# EAGLE schematic main (EAGLE 6.2)
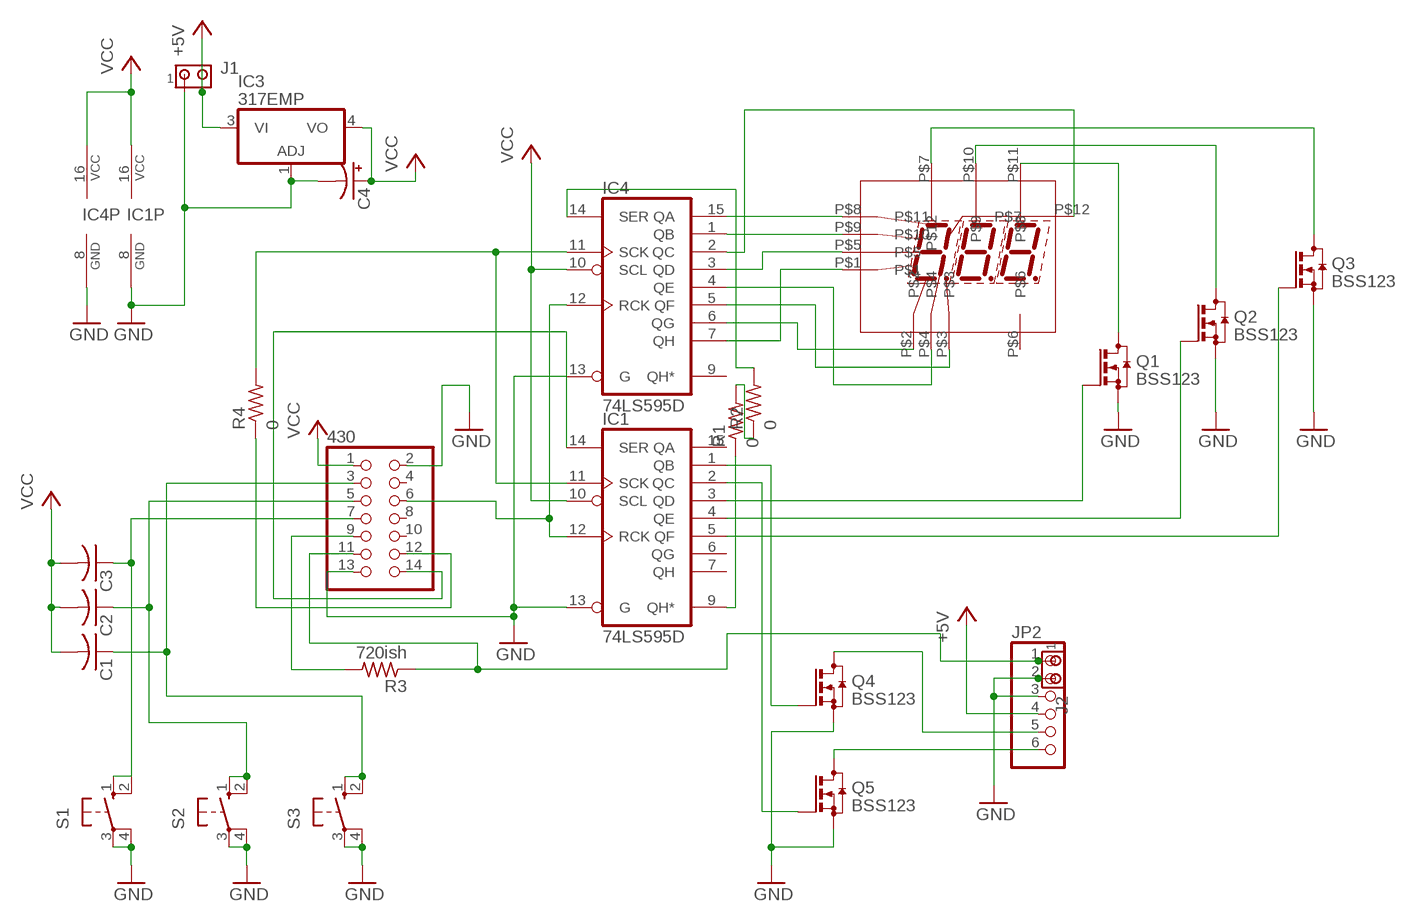
[diagram p0: schematic, sheet 1]

## Parts
430  PINHD-2X7  [2X07]
C1  C-USC0603K  [C0603K]
C2  C-USC0603K  [C0603K]
C3  C-USC0603K  [C0603K]
C4  CPOL-USE2.5-7  [E2,5-7]
IC1  74LS595D  [SO16]
IC3  317EMP  [SOT223]
IC4  74LS595D  [SO16]
J1  MTA02-100  [10X02MTA]
J2  MTA02-100  [10X02MTA]
JP2  PINHD-1X6  [1X06]
Q1  BSS123  [SOT23]
Q2  BSS123  [SOT23]
Q3  BSS123  [SOT23]
Q4  BSS123  [SOT23]
Q5  BSS123  [SOT23]
R1  0  R-US_R0603  [R0603]
R2  0  R-US_R0603  [R0603]
R3  720ish  R-US_R0805  [R0805]
R4  0  R-US_R0603  [R0603]
S1  10-XX  [B3F-10XX]
S2  10-XX  [B3F-10XX]
S3  10-XX  [B3F-10XX]
U$1  BL-T52C-31  [BL-T52X-31]

## Nets
+5V: IC3.3(VI) J1.2 JP2.4
GND: 430.2 430.13 C4.- IC1.8(GND) IC1.13(G) IC3.1(ADJ) IC4.8(GND) IC4.13(G) J1.1 J2.2 JP2.2 JP2.3 Q1.2(S) Q2.2(S) Q3.2(S) Q4.2(S) Q5.2(S) S1.3(P) S1.4(P1) S2.3(P) S2.4(P1) S3.3(P) S3.4(P1)
N$1: IC4.15(QA) U$1.P$8
N$2: IC4.1(QB) U$1.P$9
N$3: IC4.7(QH) U$1.P$1
N$4: IC4.6(QG) U$1.P$2
N$5: IC4.5(QF) U$1.P$3
N$6: IC4.4(QE) U$1.P$4
N$7: IC4.3(QD) U$1.P$5
N$8: IC4.2(QC) U$1.P$12
N$9: Q1.3(D) U$1.P$11
N$10: Q2.3(D) U$1.P$10
N$11: Q3.3(D) U$1.P$7
N$12: IC1.3(QD) Q1.1(G)
N$13: 430.14 IC1.14(SER)
N$14: IC4.14(SER) R2.2
N$15: 430.7 C3.1 S1.1(S) S1.2(S1)
N$16: IC1.9(QH*) R1.1
N$17: 430.11 J2.1 JP2.1 R3.1
N$18: 430.3 C1.1 S3.1(S) S3.2(S1)
N$19: R1.2 R2.1
N$20: IC1.1(QB) Q4.1(G)
N$21: IC1.11(SCK) IC4.11(SCK) R4.2
N$22: IC1.4(QE) Q2.1(G)
N$23: JP2.5 Q4.3(D)
N$24: IC1.5(QF) Q3.1(G)
N$25: IC1.2(QC) Q5.1(G)
N$26: 430.12 R4.1
N$28: JP2.6 Q5.3(D)
N$29: 430.5 C2.1 S2.1(S) S2.2(S1)
N$30: 430.6 IC1.12(RCK) IC4.12(RCK)
N$31: 430.9 R3.2
VCC: 430.1 C1.2 C2.2 C3.2 C4.+ IC1.10(SCL) IC1.16(VCC) IC3.4(VO) IC4.10(SCL) IC4.16(VCC)
Unconnected: 430.4 430.8 430.10 IC1.6(QG) IC1.7(QH) IC1.15(QA) IC4.9(QH*) U$1.P$6

## Library data of the parts
430 = pinhead:PINHD-2X7: PIN HEADER
C1-C3 = rcl:C-US: CAPACITOR, American symbol
C4 = rcl:CPOL-US: POLARIZED CAPACITOR, American symbol
IC1 IC4 = 74xx-us:74*595: 8-bit SHIFT REGISTER, output latch
IC3 = linear:*317: Positive VOLTAGE REGULATOR
J1 J2 = con-amp:MTA02-100: AMP connector
JP2 = pinhead:PINHD-1X6: PIN HEADER
Q1-Q5 = transistor-small-signal:BSS123: N-CHANNEL MOS FET
R1-R4 = rcl:R-US_: RESISTOR, American symbol
S1-S3 = switch-omron:10-XX: OMRON SWITCH; MPN: B3F-1000; OC_FARNELL: 176432; OC_NEWARK: 36M3542
U$1 = mjg:BL-T52C-31